# EAGLE design smd trans breakout (EAGLE 9.5.1)
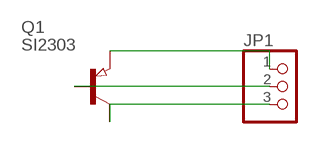
[diagram p0: schematic, sheet 1]

## Parts
JP1  PINHD-1X3  [1X03]
Q1  SI2303  PNP-TRANSISTOR_SOT23  [SOT23]

## Nets
N$1: JP1.1 Q1.2(E)
N$2: JP1.2 Q1.1(B)
N$3: JP1.3 Q1.3(C)

## Library data of the parts
JP1 = pinhead:PINHD-1X3: PIN HEADER
Q1 = semicon-smd-ipc:PNP-TRANSISTOR_: PNP TRANSISTOR

## Board
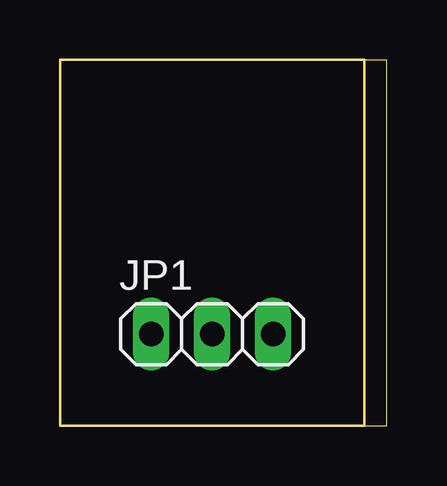
[diagram p1: board, top side]
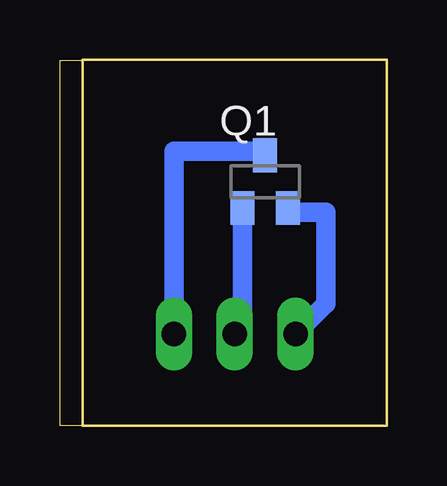
[diagram p2: board, bottom side, seen from below]

Size 13.64 x 15.23 mm. Coordinates in mm from the lower left corner, seen from the top.
Outline: 0,0 13.64,0 13.64,15.23 0,15.23 0,0
Copper layers (1*16): Top 0.035mm / dielectric 1.5mm / Bottom 0.035mm
Design rules "default": minimum track width 6mil, minimum drill 0.35mm, track to track 6mil, track to pad 6mil, pad to pad 6mil, via to via 6mil, smd to smd 6mil, copper to edge 40mil, drill to drill 6mil, minimum pad ring 10mil, minimum via ring 8mil, stop-mask expansion 4mil, vias tented up to drill 0mil, thermal gap 10mil
Milling: 4 lines

### Footprints (pad centres in the part's own frame; a part is rotated, then mirrored left to right if it is on the bottom)
1X03 = drill 1.016 long: 1 -2.54,0; 2 0,0; 3 2.54,0
SOT23 = smd 1 x 1.4: 1 -0.95,-1.1; 2 0.95,-1.1; 3 0,1.1

### Placement (x,y rotation side)
JP1  6.35,3.81 0 top
Q1  5.08,10.16 0 bottom

### Tracks (layer width: path | path; a pad name or v marks a point on that pad's centre or on a via)
N$1
  Bottom 0.813: JP1.1 2.54,5.08 2.54,8.89 3.96,8.89 Q1.2
N$2
  Bottom 0.813: JP1.2 6.03,4.13 Q1.1
N$3
  Bottom 0.813: JP1.3 8.89,11.43 5.25,11.43 Q1.3